# EAGLE design main (EAGLE 7.0.0)
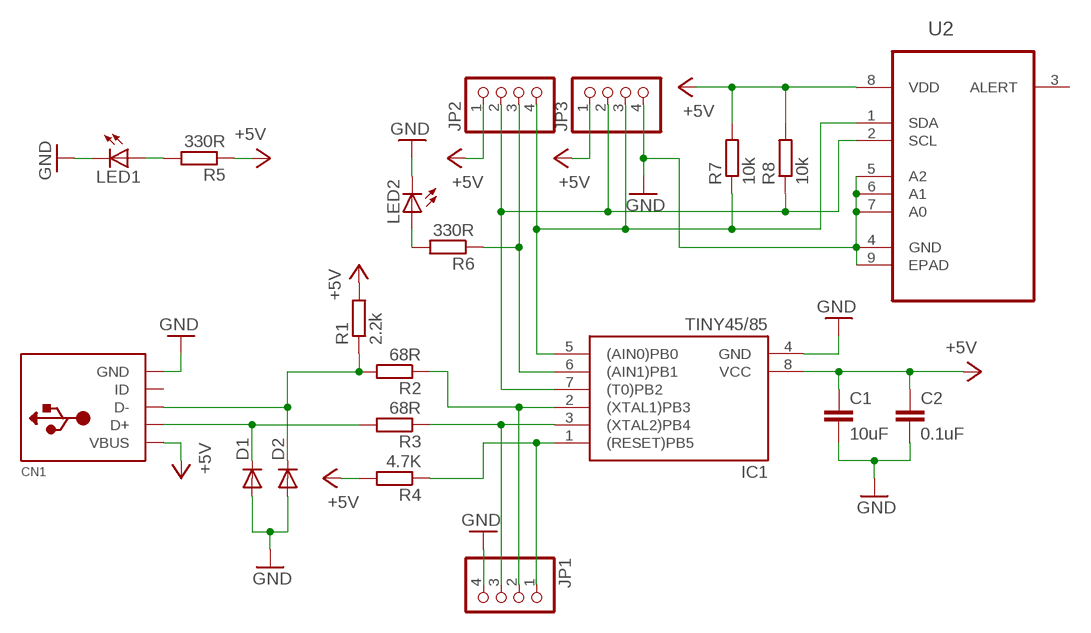
[diagram p0: schematic, sheet 1]

## Parts
C1  10uF  C-EUC0805  [C0805]
C2  0.1uF  C-EUC0805  [C0805]
CN1  USBMINIB  [USB-MINIB]
D1  DIODE-SOD323-W  [SOD323-W]
D2  DIODE-SOD323-W  [SOD323-W]
IC1  TINY45/85  [SOIC8]
JP1  PINHD-1X4  [1X04]
JP2  PINHD-1X4  [1X04]
JP3  PINHD-1X4  [1X04]
LED1  LEDCHIPLED_0603  [CHIPLED_0603]
LED2  LEDCHIPLED_0603  [CHIPLED_0603]
R1  2.2k  R-EU_R0805  [R0805]
R2  68R  R-EU_R0805  [R0805]
R3  68R  R-EU_R0805  [R0805]
R4  4.7K  R-EU_R0805  [R0805]
R5  330R  R-EU_R0805  [R0805]
R6  330R  R-EU_R0805  [R0805]
R7  10k  R-EU_R0805  [R0805]
R8  10k  R-EU_R0805  [R0805]
U2  MCP9808T-E/MC  [DFN300X200X100-9N]

## Nets
+5V: C1.1 C2.1 CN1.VBUS IC1.8(VCC) JP2.1 JP3.1 R1.2 R4.2 R5.1 R7.2 R8.2
GND: C1.2 C2.2 CN1.GND D1.A D2.A IC1.4(GND) JP1.4 JP3.4 LED1.C LED2.C U2.4(GND) U2.5(A2) U2.6(A1) U2.7(A0) U2.9(EPAD)
N$1: IC1.2((XTAL1)PB3) JP1.2 R2.1
N$2: LED1.A R5.2
N$3: IC1.6((AIN1)PB1) JP2.3 R6.1
N$4: LED2.A R6.2
N$5: IC1.7((T0)PB2) JP2.2 JP3.2 R8.1 U2.2(SCL)
N$6: IC1.1((RESET)PB5) JP1.1 R4.1
N$7: IC1.3((XTAL2)PB4) JP1.3 R3.1
N$8: CN1.D- D2.C R1.1 R2.2
N$9: IC1.5((AIN0)PB0) JP2.4 JP3.3 R7.1 U2.1(SDA)
N$10: CN1.D+ D1.C R3.2
Unconnected: CN1.ID U2.3(ALERT)

## Power pins joined to a net without a drawn wire
VDD: U2.8(VDD)

## Library data of the parts
C1 C2 = rcl:C-EU: CAPACITOR, European symbol
CN1 = adafruit:USB: USB Connectors USBMINIB - Surface Mount Female Mini-B USB Connector 4UConnector: 06564 By microbuilder.eu Thru-hole RA Female Mini-B USB Connector 4UConnector: 18732 By ladyada.net
D1 D2 = diode:DIODE-: DIODE
IC1 = atmel:TINY45/85
JP1-JP3 = pinhead:PINHD-1X4: PIN HEADER
LED1 LED2 = led:LED: LED OSRAM: - CHIPLED LG R971, LG N971, LY N971, LG Q971, LY Q971, LO R971, LY R971 LH N974, LH R974 LS Q976, LO Q976, LY Q976 LO Q996 - Hyper CHIPLED LW Q18S LB Q993, LB Q99A, LB R99A - SideLED LS A670, LO A670, LY A670, LG A670, LP A670 LB A673, LV A673, LT A673, LW A673 LH A674 LY A675 LS A676, LA A676, LO A676, LY A676, LW A676 LS A679, LY A679, LG A679 - Hyper Micro SIDELED® LS Y876, LA Y876, LO Y876, LY Y876 LT Y87S - SmartLED LW L88C, LW L88S LB L89C, LB L89S, LG L890 LS L89K, LO L89K, LY L89K LS L896, LA L896, LO L896, LY L896 - TOPLED LS T670, LO T670, LY T670, LG T670, LP T670 LSG T670, LSP T670, LSY T670, LOP T670, LYG T670 LG T671, LOG T671, LSG T671 LB T673, LV T673, LT T673, LW T673 LH T674 LS T676, LA T676, LO T676, LY T676, LB T676, LH T676, LSB T676, LW T676 LB T67C, LV T67C, LT T67C, LS T67K, LO T67K, LY T67K, LW E67C LS E67B, LA E67B, LO E67B, LY E67B, LB E67C, LV E67C, LT E67C LW T67C LS T679, LY T679, LG T679 LS T770, LO T770, LY T770, LG T770, LP T770 LB T773, LV T773, LT T773, LW T773 LH T774 LS E675, LA E675, LY E675, LS T675 LS T776, LA T776, LO T776, LY T776, LB T776 LHGB T686 LT T68C, LB T68C - Hyper Mini TOPLED® LB M676 - Mini TOPLED Santana® LG M470 LS M47K, LO M47K, LY M47K Source: http://www.osram.convergy.de LUXEON: - LUMILED® LXK2-PW12-R00, LXK2-PW12-S00, LXK2-PW14-U00, LXK2-PW14-V00 LXK2-PM12-R00, LXK2-PM12-S00, LXK2-PM14-U00 LXK2-PE12-Q00, LXK2-PE12-R00, LXK2-PE12-S00, LXK2-PE14-T00, LXK2-PE14-U00 LXK2-PB12-K00, LXK2-PB12-L00, LXK2-PB12-M00, LXK2-PB14-N00, LXK2-PB14-P00, LXK2-PB14-Q00 LXK2-PR12-L00, LXK2-PR12-M00, LXK2-PR14-Q00, LXK2-PR14-R00 LXK2-PD12-Q00, LXK2-PD12-R00, LXK2-PD12-S00 LXK2-PH12-R00, LXK2-PH12-S00 LXK2-PL12-P00, LXK2-PL12-Q00, LXK2-PL12-R00 Source: www.luxeon.com KINGBRIGHT: KA-3528ASYC Source: www.kingbright.com
R1-R6 = rcl:R-EU_: RESISTOR, European symbol
R7 R8 = resistor:R-EU_: RESISTOR, European symbol
U2 = mattsLib:MCP9808T-E/MC: TEMP SENSOR, I2C, -20 TO 100 DEG, 8DFN; MPN: MCP9808T-E/MC; OC_FARNELL: 2080524; OC_NEWARK: 73T0714; PACKAGE: 8DFN; SUPPLIER: Microchip

## Board
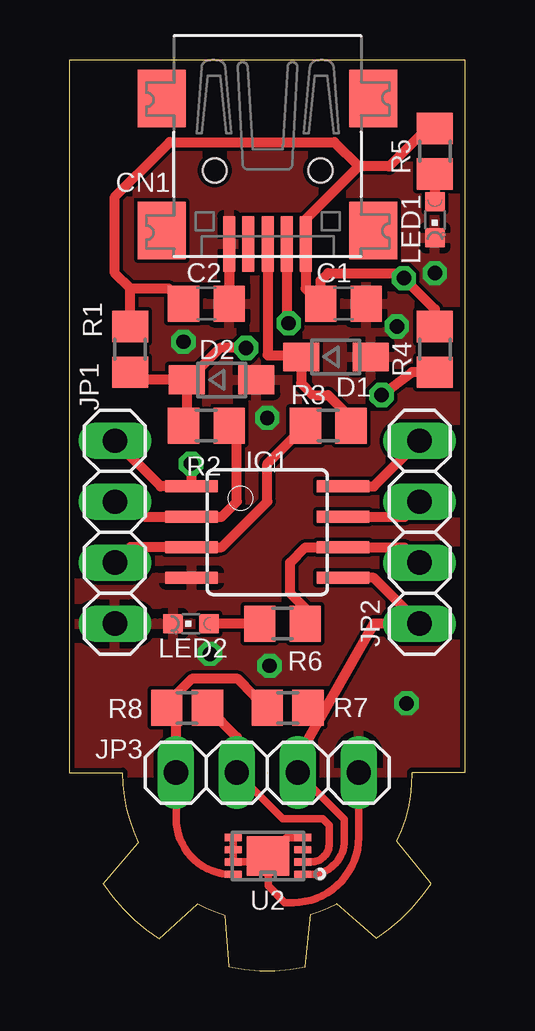
[diagram p1: board, top side]
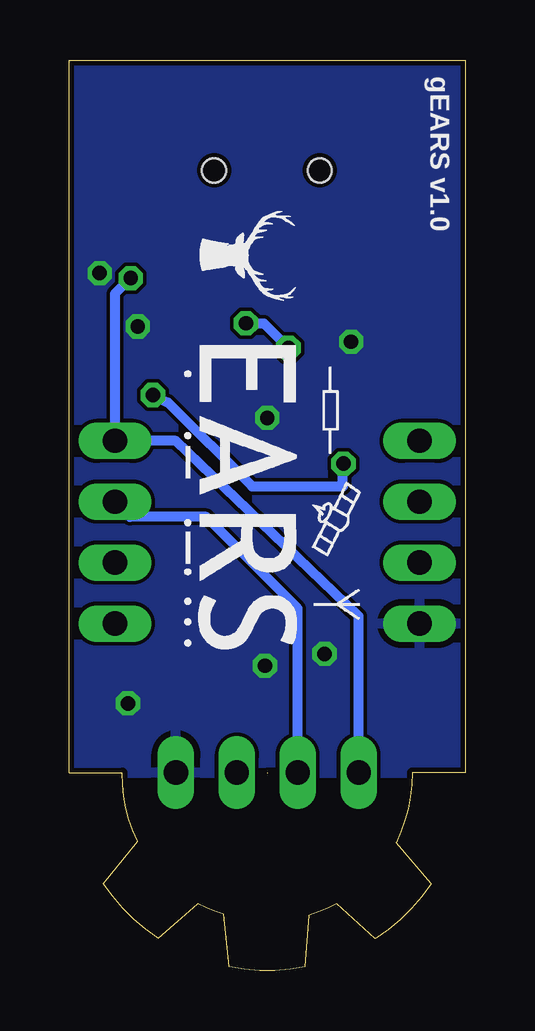
[diagram p2: board, bottom side, seen from below]

Size 16.51 x 37.94 mm. Coordinates in mm from the lower left corner, seen from the top.
Outline: 16.5,8.24 16.5,37.94 0,37.94 0,8.24 2.22,8.24 arc26 2.89,5.32 1.43,3.61 arc23 3.75,1.32 5.37,2.78 arc11 6.51,2.31 6.67,0.15 arc22 9.84,0.15 10.06,2.34 arc11 11.14,2.78 12.8,1.35 arc22 15.08,3.61 13.65,5.39 arc28 14.29,8.24 16.51,8.24
Outline: 8.25,8.24 8.25,8.21
Copper layers (1*16): Top 0.035mm / dielectric 1.5mm / Bottom 0.035mm
Design rules "electrodragon": minimum track width 6mil, minimum drill 12mil, track to track 6mil, track to pad 6mil, pad to pad 6mil, via to via 6mil, smd to smd 0mil, copper to edge 8mil, drill to drill 6mil, minimum pad ring 10mil, minimum via ring 8mil, stop-mask expansion 4mil, vias tented up to drill 0mil, thermal gap 10mil

### Footprints (pad centres in the part's own frame; a part is rotated, then mirrored left to right if it is on the bottom)
C0805 = smd 1.3 x 1.5: 1 -0.95,0; 2 0.95,0
USB-MINIB = smd 0.5 x 2.308: D+ 0,4.064; D- -0.8,4.064; GND 1.6,4.064; ID 0.8,4.064; VBUS -1.6,4.064 | smd 2 x 2.4: GND1 -4.4,-2; GND2 -4.4,3.5; GND3 4.4,3.5; GND4 4.4,-2 | hole 1: -2.2,1; 2.2,1
SOD323-W = smd 1.5 x 1.2: A 1.45,0; C -1.45,0
SOIC8 = smd 0.5 x 2.2: 1 -1.905,-3.154; 2 -0.645,-3.154; 3 0.625,-3.154; 4 1.895,-3.154; 5 1.905,3.154; 6 0.635,3.154; 7 -0.635,3.154; 8 -1.905,3.154
1X04 = drill 1.016 long: 1 -3.81,0; 2 -1.27,0; 3 1.27,0; 4 3.81,0
CHIPLED_0603 = smd 0.8 x 0.8: A 0,-0.75; C 0,0.75
R0805 = smd 1.3 x 1.5: 1 -0.95,0; 2 0.95,0
R0805' = smd 1.3 x 1.5: 1 -0.85,0; 2 0.85,0
DFN300X200X100-9N = smd 0.711 x 0.305: 1 -1.448,0.762; 2 -1.448,0.254; 3 -1.448,-0.254; 4 -1.448,-0.762; 5 1.448,-0.762; 6 1.448,-0.254; 7 1.448,0.254; 8 1.448,0.762 | smd 1.753 x 1.651: 9 0,0

### Placement (x,y rotation side)
C1  11.43,27.79 0 top
C2  5.71,27.79 0 top
CN1  8.27,34.34 180 top
D1  11.11,25.57 0 top
D2  6.35,24.61 0 top
IC1  8.25,18.26 270 top
JP1  1.9,18.26 270 top
JP2  14.61,18.26 270 top
JP3  8.25,8.24 0 top
LED1  15.24,31.28 180 top
LED2  5.08,14.45 90 top
R1  2.54,25.88 90 top
R2  5.71,22.71 180 top
R3  10.79,22.71 0 top
R4  15.24,25.88 90 top
R5  15.24,34.14 270 top
R6  8.89,14.45 180 top
R7  10k  [R0805']  9.11,10.95 180 top
R8  10k  [R0805']  4.91,10.95 180 top
U2  8.29,4.78 180 top

### Tracks (layer width: path | path; a pad name or v marks a point on that pad's centre or on a via)
+5V  (via drill 0.6)
  Top 0.406: IC1.8 12.7,20.17 JP2.1 | R5.1 14.92,35.09 13.33,33.5 12.06,33.5 | R1.2 2.54,28.42 | 2.54,28.42 1.9,29.06 1.9,32.23 3.81,34.14 3.82,34.14 4.19,34.51 11.06,34.51 12.06,33.5 | 2.54,28.42 4.13,28.42 C2.1 | 9.86,28.41 9.87,28.4 | 9.87,28.4 C1.1 10.48,28.74 10.8,29.06 13.74,29.06 v13.94,28.85 15.24,27.55 R4.2 | 12.06,33.5 9.86,31.29 9.87,31.28 CN1.VBUS 9.87,28.4 | 4.46,8.26 arc-90 JP3.1 4.45,10.95 | R7.2 7.72,11.46 7.03,12.15 5.11,12.15 4.45,11.48 4.45,10.95 | 4.45,10.95 R8.2
  Bottom 0.406: JP3.1 4.45,14.77 12.06,22.07 JP2.1 14.61,28.19 v13.94,28.85
GND  (via drill 0.6)
  Top 0.305: JP3.4 12.06,5.56 arc-90 9.33,2.83 8.99,2.83 8.29,3.54 U2.9 | U2.9 8.03,4.52 U2.7 U2.6 U2.5 | U2.9 9.05,5.54 U2.4
  Top 0.406: CN1.GND C2.2
  other vias: 8.25,23.03 4.76,26.2 15.24,29.06 13.65,26.84 14.06,11.13 8.35,12.7 5.87,13.2
  pour Bottom: 0,8.24 0,37.95 16.51,37.95 16.51,8.24
  pour Top: 0,8.24 0,37.95 16.51,37.95 16.51,8.24
N$1
  Top 0.406: JP1.2 2.54,19.53 3.17,18.9 IC1.2 6.36,18.91 6.99,19.53 6.99,22.39 R2.1
N$2
  Top 0.406: R5.2 LED1.A
N$3
  Top 0.406: JP2.3 13.97,17.63 IC1.6 9.84,17.63 9.21,16.99 9.21,15.72 9.84,15.09 R6.1
N$4
  Top 0.406: R6.2 LED2.A
N$5
  Top 0.305: U2.2 10.07,4.52 arc90 10.84,5.29 10.84,6.05 10.57,6.32 8.91,6.32 JP3.2
  Top 0.406: IC1.7 13.97,18.9 JP2.2 | R8.1 6.99,9.73 JP3.2
  Bottom 0.406: JP3.2 6.99,15.09 10.8,18.9 13.97,18.9 JP2.2
N$6  (via drill 0.6)
  Top 0.406: JP1.1 3.81,20.17 IC1.1 5.08,20.19 v5.08,21.12 | R4.1 14.29,24.93 v13.02,23.98
  Bottom 0.406: v13.02,23.98 12.38,23.66 8.89,20.17 IC1.1 5.1,21.1 v5.08,21.12
N$7
  Top 0.406: JP1.3 2.55,17.64 IC1.3 6.36,17.64 8.25,19.53 8.25,21.12 R3.1
N$8  (via drill 0.6)
  Top 0.406: D2.C 4.9,23.21 R2.2 | D2.C 2.86,24.61 R1.1 | D2.C 4.96,24.61 6.29,25.94 v7.37,25.94 | CN1.D- 9.07,27.22 v9.14,26.97
  Bottom 0.406: v9.14,26.97 8.4,26.97 v7.37,25.94
N$9
  Top 0.305: 9.53,8.15 JP3.3 11.47,6.3 11.47,5.41 arc-90 10.08,4.02 U2.1
  Top 0.406: IC1.5 12.7,16.36 JP2.4 12.7,14.45 10.36,10.34 | 10.36,10.34 9.53,8.88 JP3.3 | R7.1 10.36,10.34
N$10
  Top 0.406: R3.2 11.43,23.02 11.43,23.34 10.8,23.98 10.16,23.98 9.66,24.48 D1.C 9.59,25.64 8.29,25.64 8.27,25.66 CN1.D+
N$11
  Top 0.305: 6.8,4 arc-90 4.46,6.34 4.46,8.19

### Text on the board
bNames: gEARS v1.0